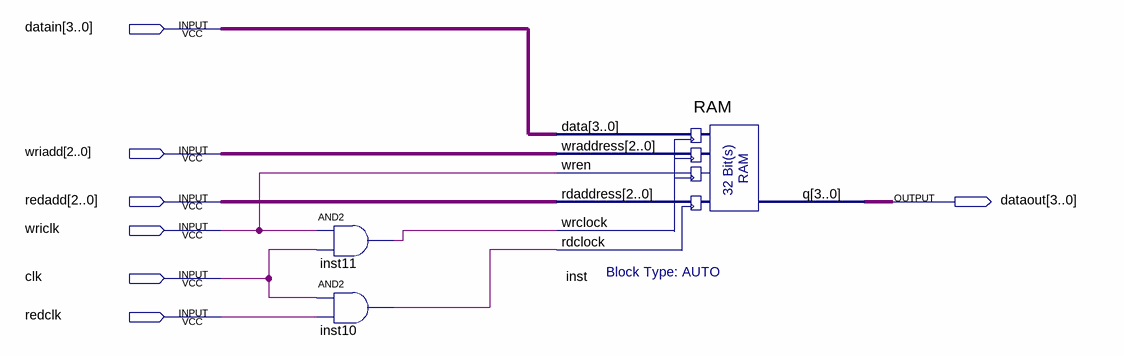
[diagram p0: schematic sheet]
// Quartus schematic memory.bdf as structural Verilog: 3 symbols, 7 pins
module memory (
  input  [3:0] datain,
  input  [2:0] wriadd,
  input  [2:0] redadd,
  input  wriclk,
  input  clk,
  input  redclk,
  output [3:0] dataout
);

  wire inst10_out, inst11_out;

  and inst11 (inst11_out, wriclk, clk);
  and inst10 (inst10_out, clk, redclk);
  RAM inst (
    .data(datain), .wraddress(wriadd), .wren(wriclk), .rdaddress(redadd), .wrclock(inst11_out),
    .rdclock(inst10_out), .q(dataout));
endmodule
